# Altium schematic sheet Power Entry 24v-3pin Fused-1A5.SchDoc: Power Supply Entry
size A4; Organization: Altium Limited; Address1: 3 Minna Close; Address2: Belrose; Address3: NSW 2085; Address4: Australia
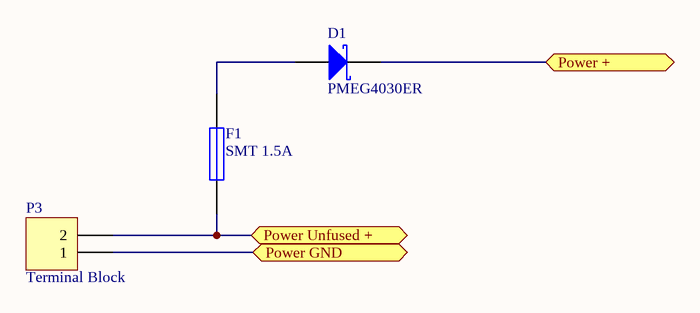
[diagram p0: Power Entry 24v-3pin Fused-1A5.SchDoc]

## Parts
D1  PMEG4030ER  [SOD123W]
F1  SMT 1.5A  [F_2920L185]
P3  Terminal Block  [TB2_3.5]

## Ports
Power +, Power GND, Power Unfused +

## Nets
Power +: D1.2 ; port Power +
Power GND: P3.1 ; port Power GND
Power Unfused +: F1.1 P3.2 ; port Power Unfused +
NetD1_1: D1.1 F1.2

## Notes on the sheet
- Disclaimer
  Any design and information, hardware or software  is provided on an "as-is" basis without warranty of any kind and any express or implied warranties, including, but not limited to, the implied warranties of merchantability and fitness for a particular purpose are disclaimed. In no event shall wnpd (or KeaDrone)be liable for any direct, indirect, incidental, special, exemplary, or consequential damages (including, but not limited to, procurement of substitute goods or services; loss of use, data, or profits; or business interruption) however caused and on any theory of liability, whether in contract, strict liability, or tort (including negligence or otherwise) arising in any way out of the use of this firmware, hardware, software or information, even if wnpd (or KeaDrone) has been advised by user of the possibility of such potential loss or damage. The user agrees to hold wnpd (or KeaDrone) harmless from and against any and all claims, losses, liabilities and expenses.
- Title
- Size:
- Date:
- A4
- Name:
- Time:
- Ing. W. Pietersz
- Revision:
- Sheet
- of
- WillyPietersz@gmail.com
- Contact:
- -
- www.wnpd.nl
- File:

## Library data of the parts
D1 = PMEG4030ER: Voltage: 40V; Current: 3A; LatestRevision Note: Initial Release; Part Number: PMEG4030ER; Type: Schottky; Package: SOD123W; Component Type: Standard; LatestRevision Date: 29-9-2010 9:43:01; Author: Willem Pietersz; ROHS: Y; Supplier 2: Farnell; Supplier Part Number 2: 1829202; ComponentLink2Description: Datasheet; ComponentLink2URL: http://www.nxp.com/documents/data_sheet/PMEG4030ER.pdf
F1 = 2920L185: Fuse; Manufacturer 1: Littlefuse; Voltage: 30V; Published: 8-Jun-2000; LatestRevisionDate: 17-Jul-2002; LatestRevisionNote: Re-released for DXP Platform.; PackageReference: PIN-W2/E2.8; Publisher: Altium Limited; Part Number: 2920L185; Current: 1.5A; Manufacturer 1 Part No: 2920L185; Supplier 2: Farnell; Supplier Part Number 2: 1822228; ComponentLink1Description: Datasheet; ComponentLink1URL: http://www.farnell.com/datasheets/578244.pdf
P3 = TB2: Con1x2; Part Number: TB2; Current: 10; Voltage: 300; Pitch: 3,5; LatestRevision Note: Initial Release; Type: Terminal Block; Number Of Pins: 2; Component Type: Standard; LatestRevision Date: 23-11-2010; Author: Willy Pietersz; Supplier 2: Farnell